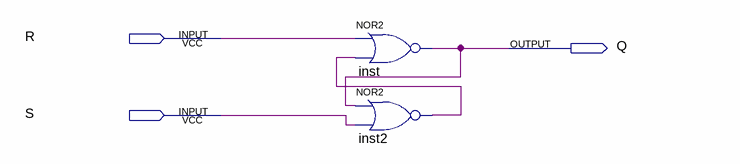
[diagram p0: schematic sheet]
// Quartus schematic 31.bdf as structural Verilog: 2 symbols, 3 pins
module \31  (
  input  R,
  input  S,
  output Q
);

  wire inst2_out;

  nor inst (Q, R, inst2_out);
  nor inst2 (inst2_out, Q, S);
endmodule
